# EAGLE design blinkm_mk2b (EAGLE 6.4)
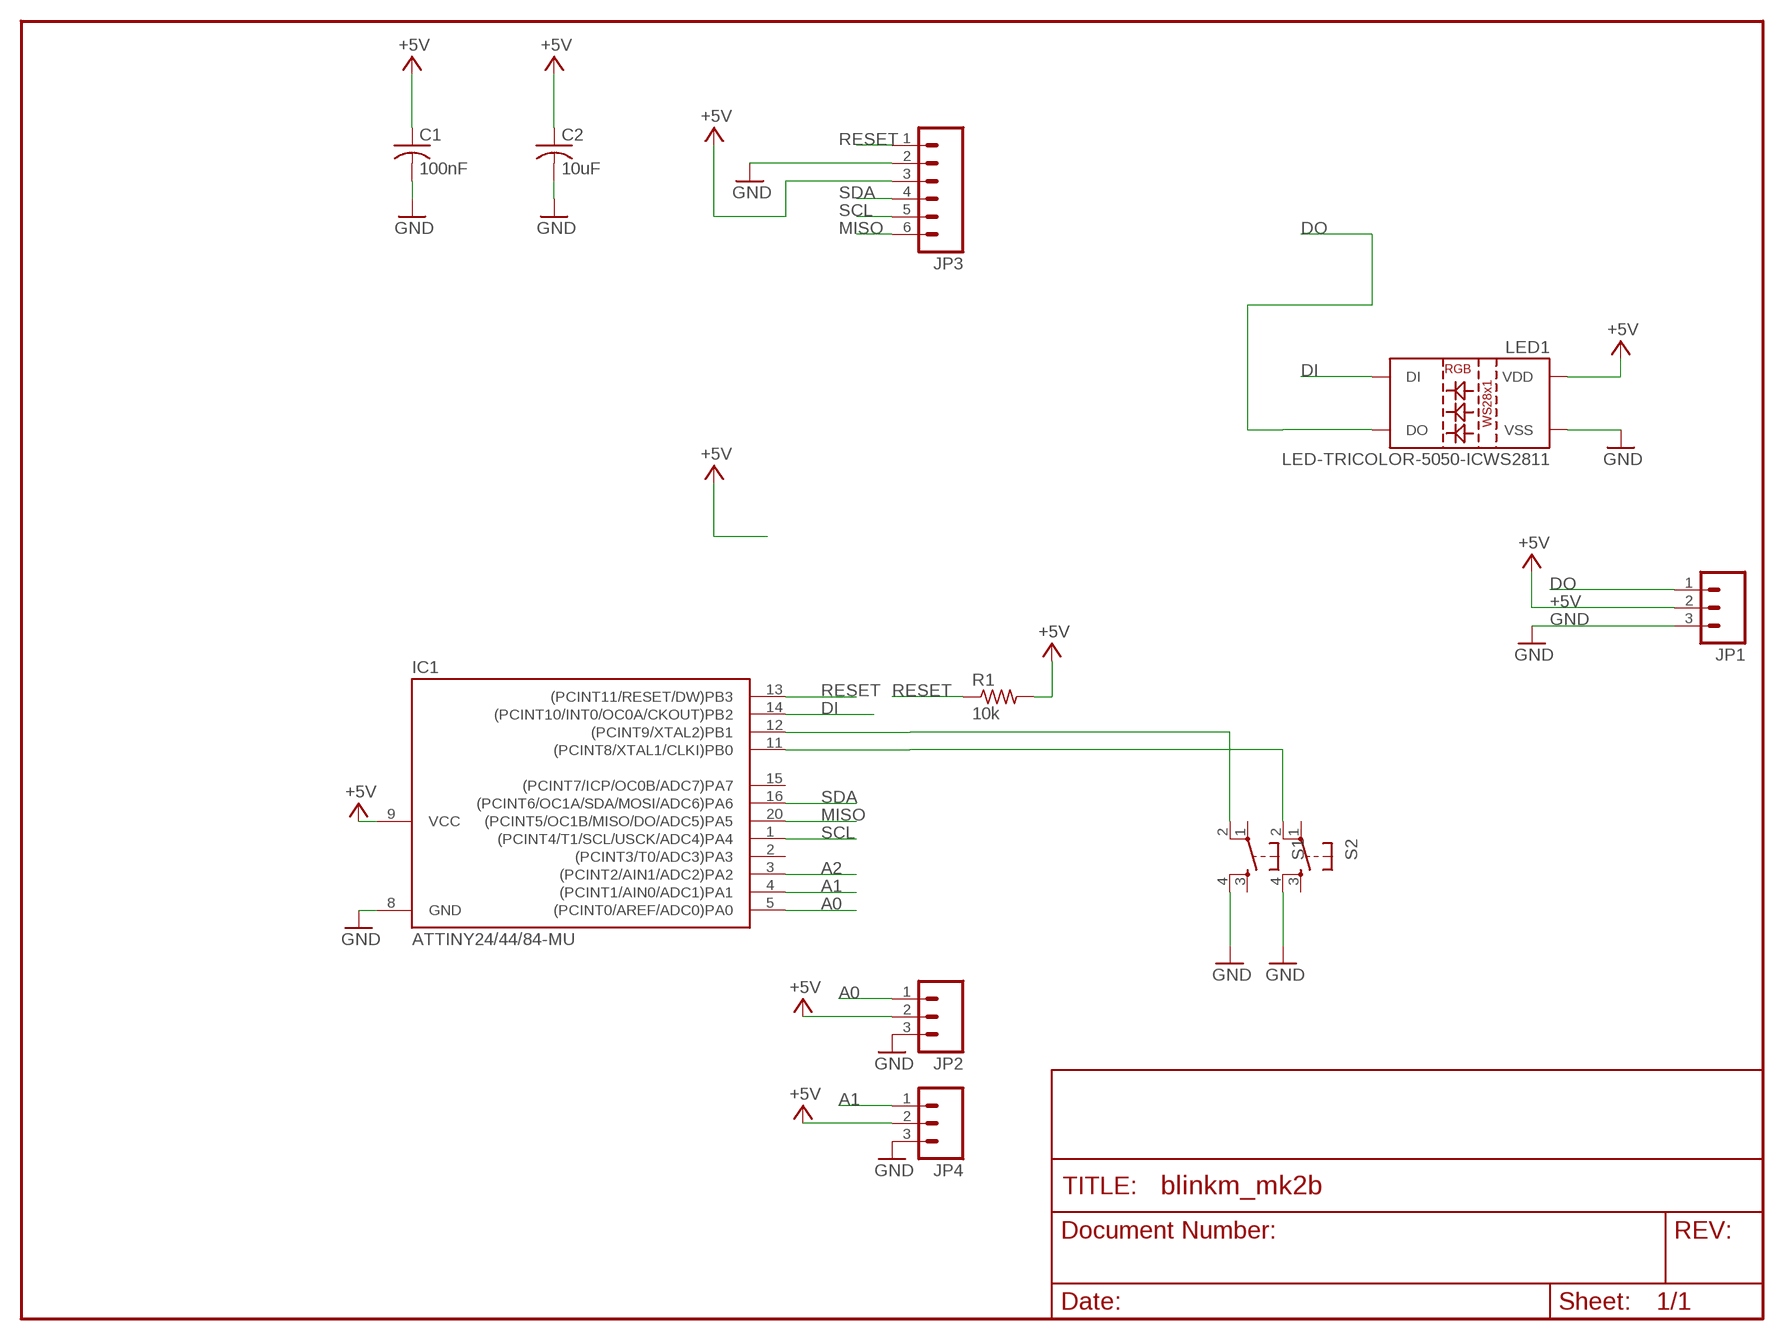
[diagram p0: schematic, sheet 1]

## Parts
C1  100nF  C-USC0603  [C0603]
C2  10uF  C-USC0603  [C0603]
IC1  ATTINY24/44/84-MU  [QFN/MLF20]
JP1  M03PTH  [1X03]
JP2  M03PTH  [1X03]
JP3  M06SIP  [1X06]
JP4  M03PTH  [1X03]
LED1  LED-TRICOLOR-5050-ICWS2811  [LED-TRICOLOR-5050-IC]
R1  10k  R-US_R0603  [R0603]
S1  TAC_SWITCHSMD  [TACTILE_SWITCH_SMD]
S2  TAC_SWITCHSMD  [TACTILE_SWITCH_SMD]

## Nets
+5V: C1.1 C2.1 IC1.9(VCC) JP1.2 JP2.2 JP3.3 JP4.2 LED1.3(VDD) LED1.5(VDD) R1.2
A0: IC1.5((PCINT0/AREF/ADC0)PA0) JP2.1
A1: IC1.4((PCINT1/AIN0/ADC1)PA1) JP4.1
A2: IC1.3((PCINT2/AIN1/ADC2)PA2)
DI: IC1.14((PCINT10/INT0/OC0A/CKOUT)PB2) LED1.2(DI)
DO: JP1.1 LED1.1(DO)
GND: C1.2 C2.2 IC1.8(GND) JP1.3 JP2.3 JP3.2 JP4.3 LED1.6(VSS) S1.4 S2.4
MISO: IC1.20((PCINT5/OC1B/MISO/DO/ADC5)PA5) JP3.6
N$5: IC1.12((PCINT9/XTAL2)PB1) S1.2
N$7: IC1.11((PCINT8/XTAL1/CLKI)PB0) S2.2
RESET: IC1.13((PCINT11/RESET/DW)PB3) JP3.1 R1.1
SCL: IC1.1((PCINT4/T1/SCL/USCK/ADC4)PA4) JP3.5
SDA: IC1.16((PCINT6/OC1A/SDA/MOSI/ADC6)PA6) JP3.4
Unconnected: IC1.2((PCINT3/T0/ADC3)PA3) IC1.15((PCINT7/ICP/OC0B/ADC7)PA7) S1.1 S1.3 S2.1 S2.3

## Library data of the parts
C1 C2 = rcl:C-US: CAPACITOR, American symbol
IC1 = attiny24_44_84:ATTINY24/44/84
JP1 JP2 JP4 = SparkFun-20110517:M03: Header 3 Standard 3-pin 0.1" header. Use with straight break away headers (SKU : PRT-00116), right angle break away headers (PRT-00553), swiss pins (PRT-00743), machine pins (PRT-00117), and female headers (PRT-00115). Molex polarized connector foot print use with SKU : PRT-08232 with associated crimp pins and housings.
JP3 = SparkFun-Connectors:M06: Header 6 Standard 6-pin 0.1" header. Use with straight break away headers (SKU : PRT-00116), right angle break away headers (PRT-00553), swiss pins (PRT-00743), machine pins (PRT-00117), and female headers (PRT-00115). Molex polarized connector foot print use with SKU : PRT-08094 with associated crimp pins and housings. NOTES ON THE VARIANTS LOCK and LOCK_LONGPADS... This footprint was designed to help hold the alignment of a through-hole component (i.e. 6-pin header) while soldering it into place. You may notice that each hole has been shifted either up or down by 0.005 of an inch from it's more standard position (which is a perfectly straight line). This slight alteration caused the pins (the squares in the middle) to touch the edges of the holes. Because they are alternating, it causes a "brace" to hold the component in place. 0.005 has proven to be the perfect amount of "off-center" position when using our standard breakaway headers. Although looks a little odd when you look at the bare footprint, once you have a header in there, the alteration is very hard to notice. Also, if you push a header all the way into place, it is covered up entirely on the bottom side. This idea of altering the position of holes to aid alignment will be further integrated into the Sparkfun Library for other footprints. It can help hold any component with 3 or more connection pins.
LED1 = SparkFun-LED:LED-TRICOLOR-5050-IC: 5x5mm SMD LED with built-in controller IC.
R1 = rcl:R-US_: RESISTOR, American symbol
S1 S2 = SparkFun-Electromechanical:TAC_SWITCH: Momentary Switch Button commonly used for reset or general input. Spark Fun Electronics SKU : COM-00097 SMT- SWCH-08247; PROD_ID: SWCH-08247

## Board
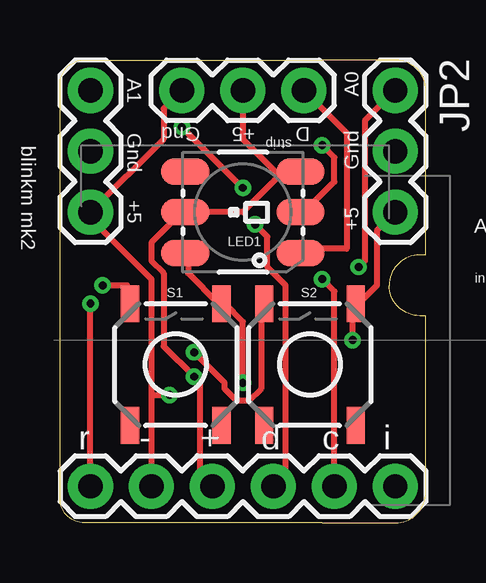
[diagram p1: board, top side]
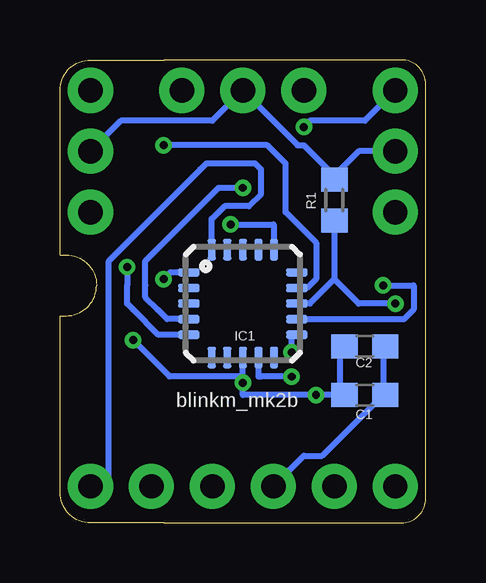
[diagram p2: board, bottom side, seen from below]

Size 15.24 x 19.3 mm. Coordinates in mm from the lower left corner, seen from the top.
Outline: 10.92,0 1.02,0 arc-90 0,1.02 0,18.29 arc-90 1.02,19.3 10.92,19.3 13.97,19.3 arc-90 15.24,18.03 15.24,11.18 14.99,11.18 arc90 13.72,9.91 arc90 14.99,8.64 15.24,8.64 15.24,1.27 arc-90 13.97,0 10.92,0
Copper layers (1*16): Top 0.0356mm / dielectric 1.5011mm / Bottom 0.0356mm
Design rules "LaenPCBOrder-tod": minimum track width 10mil, minimum drill 13mil, track to track 6mil, track to pad 8mil, pad to pad 8mil, via to via 8mil, smd to smd 6mil, copper to edge 15mil, drill to drill 8mil, minimum pad ring 7mil, minimum via ring 7mil, stop-mask expansion 4mil, vias tented up to drill 25mil, thermal gap 10mil
tRestrict: area -1.5,3.8 to -0.3,11.4
bRestrict: area 6.3,7.9 to 8.9,10.4

### Footprints (pad centres in the part's own frame; a part is rotated, then mirrored left to right if it is on the bottom)
C0603 = smd 1.1 x 1: 1 -0.85,0; 2 0.85,0
QFN/MLF20 = smd 0.9 x 0.35: 1 -2.25,1.3; 2 -2.25,0.65; 3 -2.25,0; 4 -2.25,-0.65; 5 -2.25,-1.3; 11 2.25,-1.3; 12 2.25,-0.65; 13 2.25,0; 14 2.25,0.65; 15 2.25,1.3 | smd 0.35 x 0.9: 6 -1.3,-2.25; 7 -0.65,-2.25; 8 0,-2.25; 9 0.65,-2.25; 10 1.3,-2.25; 16 1.3,2.25; 17 0.65,2.25; 18 0,2.25; 19 -0.65,2.25; 20 -1.3,2.25
1X03 = drill 1.016 pad 1.88: 1 0,0; 2 2.54,0; 3 5.08,0
1X06 = drill 1.016 pad 1.88: 1 0,0; 2 2.54,0; 3 5.08,0; 4 7.62,0; 5 10.16,0; 6 12.7,0
LED-TRICOLOR-5050-IC = smd 2 x 1.1: 1 -2.4,1.7; 2 -2.4,0; 3 -2.4,-1.7; 4 2.4,-1.7; 5 2.4,0; 6 2.4,1.7
R0603 = smd 1 x 1.1: 1 -0.85,0; 2 0.85,0
TACTILE_SWITCH_SMD = smd 1.524 x 0.762: 1 -2.54,1.905; 2 2.54,1.905; 3 -2.54,-1.905; 4 2.54,-1.905

### Placement (x,y rotation side)
C1  2.54,5.33 180 bottom
C2  2.54,7.37 180 bottom
IC1  7.62,9.14 0 bottom
JP1  10.16,18.03 180 top
JP2  13.97,18.03 270 top
JP3  1.27,1.52 0 top
JP4  1.27,18.03 270 top
LED1  7.62,12.95 180 top
R1  3.81,13.46 90 bottom
S1  4.83,6.6 90 top
S2  10.41,6.6 90 top

### Tracks (layer width: path | path; a pad name or v marks a point on that pad's centre or on a via)
+5V  (via drill 0.33)
  Top 0.254: JP3.3 5.84,2.03 5.84,5.84 v5.59,6.1 4.32,7.37 4.32,10.41 3.81,10.92 3.81,11.68 5.08,12.95 LED1.5 5.33,12.95 7.62,12.95 9.14,14.48 | 9.14,14.48 9.91,14.48 LED1.3 9.14,14.48 | 9.14,14.48 7.62,16 JP1.2
  Bottom 0.254: 1.78,5.33 1.78,7.37 C2.1 | 1.78,5.33 C1.1 1.78,5.33 | v5.59,6.1 6.86,6.1 6.97,6.1 IC1.9 | 1.78,5.33 4.32,2.79 5.08,2.79 JP3.3 | 3.81,14.48 2.79,15.49 JP4.2 | 3.81,14.48 R1.2 3.81,14.48 | JP2.2 12.7,16.76 8.89,16.76 JP1.2 5.33,15.75 5.08,15.75 3.81,14.48
A0  (via drill 0.33)
  Top 0.254: v12.45,10.67 12.7,10.92 12.7,16.76 JP2.1
  Bottom 0.254: v12.45,10.67 12.45,9.91 12.45,9.14 12.19,8.89 11.15,7.84 IC1.5
A1  (via drill 0.33)
  Top 0.254: v5.08,16.51 v7.62,13.97
  Bottom 0.254: v7.62,13.97 8.64,13.97 10.92,11.68 11.68,10.92 11.68,9.91 11.68,9.4 11.18,8.89 10.78,8.49 IC1.4 | v5.08,16.51 4.83,16.76 2.54,16.76 JP4.1
DI  (via drill 0.33)
  Top 0.254: v10.92,15.75 11.43,15.24 11.43,14.22 10.16,12.95 LED1.2
  Bottom 0.254: IC1.14 4.94,9.79 4.57,10.16 4.57,11.68 5.84,12.95 5.84,14.99 6.6,15.75 v10.92,15.75
DO
  Top 0.254: JP1.1 11.94,16.26 11.94,11.43 10.16,11.43 LED1.1
GND  (via drill 0.33)
  Top 0.254: JP2.3 13.21,12.19 13.21,9.91 12.45,9.14 S2.4 12.19,9.14 v12.19,7.62 | LED1.6 5.33,11.18 5.33,10.41 6.6,9.14 S1.4 6.86,9.14 7.62,8.38 v7.62,5.84 | JP1.3 4.32,17.27 4.32,16 JP4.3 1.27,12.7 3.81,10.16 3.81,5.33 | 3.81,5.33 JP3.2 | 3.81,5.33 v4.57,5.33
  Bottom 0.254: IC1.8 7.62,7.11 IC1.8 | v7.62,5.84 7.62,5.33 v4.57,5.33 3.56,5.33 | v7.62,5.84 7.62,6.1 | 7.62,6.1 7.62,6.86 IC1.8 | 3.56,5.33 C1.2 3.56,5.33 | 3.56,5.33 3.56,7.37 C2.2 | v12.19,7.62 10.67,6.1 7.62,6.1 | 7.62,6.1 v7.62,5.84
  pour Top: 21.34,22.86 21.34,0 20.07,0 20.07,22.86
MISO
  Bottom 0.254: JP3.6 13.21,1.52 13.21,10.92 9.4,14.73 9.14,14.99 7.11,14.99 6.86,14.73 6.86,13.72 7.37,13.21 8.38,13.21 8.92,12.67 IC1.20
N$5  (via drill 0.33)
  Top 0.254: v1.78,9.91 2.79,9.91 2.79,9.14 S1.2
  Bottom 0.254: v1.78,9.91 0.51,9.91 0.51,8.89 0.9,8.49 IC1.12
N$7  (via drill 0.33)
  Top 0.254: v5.59,7.11 6.86,5.84 6.86,5.59 7.37,5.08 7.87,5.08 8.38,5.59 8.38,9.14 S2.2
  Bottom 0.254: v5.59,7.11 5.59,7.87 IC1.11
RESET  (via drill 0.33)
  Top 0.254: JP3.1 v1.27,9.14
  Bottom 0.254: 3.81,10.16 4.83,9.14 5.33,9.14 IC1.13 | 3.81,10.16 3.81,12.45 R1.1 | 3.81,10.16 2.79,9.14 v1.27,9.14
SCL  (via drill 0.33)
  Top 0.254: v10.92,10.16 11.43,9.65 JP3.5
  Bottom 0.254: IC1.1 10.64,10.44 v10.92,10.16
SDA  (via drill 0.33)
  Top 0.254: v8.13,12.45 8.64,11.94 8.64,10.67 9.4,9.91 9.4,2.03 JP3.4
  Bottom 0.254: v8.13,12.45 6.35,12.45 6.32,12.42 IC1.16

### Text on the board
tPlace: A1 | A0 | Gnd | +5 | D | blinkm mk2 | Gnd | strip | Gnd | +5 | A2 | +5 | inputs | r | - | + | d | c | i
bPlace: blinkm_mk2b